# Altium schematic sheet I2C IO Expander.SchDoc: I2C I/O Expander for Reading Interrupts
size A4; SheetNumber: 35; SheetTotal: 37
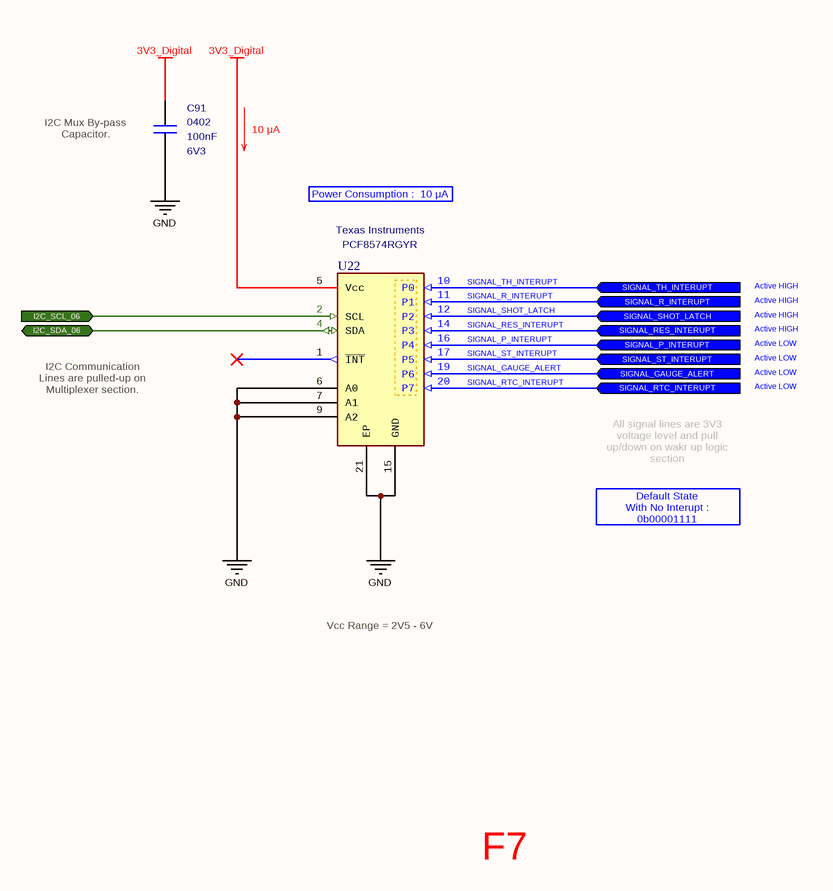
[diagram p0: I2C IO Expander.SchDoc]

## Parts
C91  value 100nF  Case: 0402  Voltage: 6V3  [CAPACITOR_0402]  (hidden comment: Multilayer Ceramic Capacitor)
U22  Manufacturer_Part_Number: PCF8574RGYR  Manufacturer_Name: Texas Instruments  [VQFN20]  (hidden comment: I2C I/O Expander)

## Ports
I2C_SCL_06 (in), I2C_SDA_06 (bidir), SIGNAL_GAUGE_ALERT (in), SIGNAL_P_INTERUPT (in), SIGNAL_R_INTERUPT (in), SIGNAL_RES_INTERUPT (in), SIGNAL_RTC_INTERUPT (in), SIGNAL_SHOT_LATCH (in), SIGNAL_ST_INTERUPT (in), SIGNAL_TH_INTERUPT (in)

## Nets
3V3_Digital: C91.2 U22.5(Vcc)
GND: C91.1 U22.6(A0) U22.7(A1) U22.9(A2) U22.15(GND) U22.21(EP)
I2C_SCL_06: U22.2(SCL) ; port I2C_SCL_06
I2C_SDA_06: U22.4(SDA) ; port I2C_SDA_06
SIGNAL_GAUGE_ALERT: U22.19(P6) ; port SIGNAL_GAUGE_ALERT
SIGNAL_P_INTERUPT: U22.16(P4) ; port SIGNAL_P_INTERUPT
SIGNAL_R_INTERUPT: U22.11(P1) ; port SIGNAL_R_INTERUPT
SIGNAL_RES_INTERUPT: U22.14(P3) ; port SIGNAL_RES_INTERUPT
SIGNAL_RTC_INTERUPT: U22.20(P7) ; port SIGNAL_RTC_INTERUPT
SIGNAL_SHOT_LATCH: U22.12(P2) ; port SIGNAL_SHOT_LATCH
SIGNAL_ST_INTERUPT: U22.17(P5) ; port SIGNAL_ST_INTERUPT
SIGNAL_TH_INTERUPT: U22.10(P0) ; port SIGNAL_TH_INTERUPT

Not connected (* = marked no-connect by the designer): U22 1(~{INT})*

## Notes on the sheet
- (near C91) I2C Mux By-pass Capacitor.
- 10 μA
- Power Consumption :  10 μA
- Active HIGH
- Active LOW
- I2C Communication Lines are pulled-up on Multiplexer section.
- All signal lines are 3V3
  voltage level and pull up/down on wakr up logic section
- Default State
  With No Interupt :
  0b00001111
- Vcc Range = 2V5 - 6V
- F7
- Title
- Size:
- Date:
- A4
- Number:
- Time:
- Revision:
- Sheet
- of
- File:

## Library data of the parts
C91 = Capacitor - 100nF [0402-6V3]: Capacitor - 100nF [0402-6V3] (Ceramic); Manufacturer_Name: AVX; Manufacturer_Part_Number: 04026D104KAT4A; Dielectric: X5R; Tolerance: %10; Height: 0.25mm; Mouser_Part_Number: 581-04026D104KAT4A; ComponentLink1Description: Mouser; ComponentLink1URL: https://www.mouser.com.tr/ProductDetail/AVX/04026D104KAT4A?qs=sGAEpiMZZMs0AnBnWHyRQPg4iYkCw7IMED%2F4kpqgf7w%3D; ComponentLink2Description: DataSheet; ComponentLink2URL: https://www.mouser.com.tr/datasheet/2/40/cx5r-776519.pdf; ROHS: Yes; Maximum Operating Temperature: +85; Minimum Operating Temperature: -55; Supplier 1: Avnet; Supplier Part Number 1: 04026D104KAT4A
U22 = IC - PCF8574RGYR: Interface - I/O Expanders Remote 8-Bit I/O Expander for I2C-Bus; Maximum Clock Frequency: 100kHz; Operating Supply Voltage: 2V5-6V; Number of I/Os: 8; Mouser_Part_Number: 595-PCF8574RGYR; ComponentLink1Description: DataSheet; ComponentLink1URL: http://www.ti.com/general/docs/suppproductinfo.tsp?distId=26&gotoUrl=http%3A%2F%2Fwww.ti.com%2Flit%2Fgpn%2Fpcf8574; ComponentLink2Description: Mouser; ComponentLink2URL: https://www.mouser.com.tr/ProductDetail/Texas-Instruments/PCF8574RGYR?qs=%2Fha2pyFaduhjLax3LUN%252BdmyxCPVA38asq087nkAFlAv0NNSQUcsx%2FA%3D%3D; ComponentLink3Description: ProductPage; ComponentLink3URL: https://www.ti.com/store/ti/en/p/product/?p=PCF8574RGYR; Case: VQFN-20; Maximum Operating Temperature: +85; Minimum Operating Temperature: -40; Supplier 1: Digi-Key; Supplier 2: Mouser; Supplier Part Number 1: 296-15173-1-ND; Supplier Part Number 2: 595-PCF8574RGYR